# EAGLE design dedo_prog (EAGLE 9.4.2)
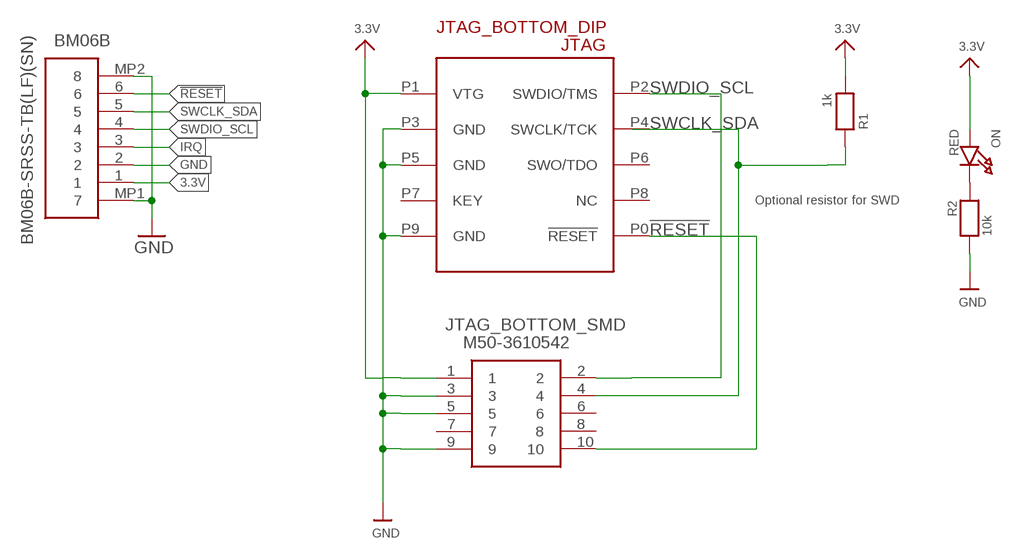
[diagram p0: schematic, sheet 1]

## Parts
BM06B  BM06B-SRSS-TB(LF)(SN)  [BM06BSRSSTBLFSN]
JTAG_BOTTOM_DIP  JTAGICE3-CONNECTOR50MIL-THT  [JTAGICE3-50MIL]
JTAG_BOTTOM_SMD  M50-3610542  [M503610542]
ON  RED  LED0603  [CHIPLED_0603]
R1  1k  RESISTOR_0402  [_0402@1]
R2  10k  RESISTOR_0402  [_0402@1]

## Nets
3.3V: BM06B.1 JTAG_BOTTOM_DIP.P1(VTG) JTAG_BOTTOM_SMD.1 ON.A R1.2
!RESET: BM06B.6 JTAG_BOTTOM_DIP.P0(!RESET) JTAG_BOTTOM_SMD.10
GND: BM06B.2 BM06B.MP1 BM06B.MP2 JTAG_BOTTOM_DIP.P3(GND) JTAG_BOTTOM_DIP.P5(GND) JTAG_BOTTOM_DIP.P9(GND) JTAG_BOTTOM_SMD.3 JTAG_BOTTOM_SMD.5 JTAG_BOTTOM_SMD.9 R2.1
IRQ: BM06B.3
N$2: ON.C R2.2
SWCLK_SDA: BM06B.5 JTAG_BOTTOM_DIP.P4(SWCLK/TCK) JTAG_BOTTOM_SMD.4 R1.1
SWDIO_SCL: BM06B.4 JTAG_BOTTOM_DIP.P2(SWDIO/TMS) JTAG_BOTTOM_SMD.2
Unconnected: JTAG_BOTTOM_DIP.P6(SWO/TDO) JTAG_BOTTOM_DIP.P7(KEY) JTAG_BOTTOM_DIP.P8(NC) JTAG_BOTTOM_SMD.6 JTAG_BOTTOM_SMD.7 JTAG_BOTTOM_SMD.8

## Notes on the sheet
- Optional resistor for SWD

## Library data of the parts
BM06B = 0SoK:BM06B-SRSS-TB(LF)(SN): connector,multipole PCB use,BM06B-SRSS-T JST SH Series, 1mm Pitch 6 Way 1 Row Straight PCB Header, Solder Termination, 1A Source: Datasheet <http://docs-emea.rs-online.com/webdocs/13ce/0900766b813ce45e.pdf>; DESCRIPTION: connector,multipole PCB use,BM06B-SRSS-T JST SH Series, 1mm Pitch 6 Way 1 Row Straight PCB Header, Solder Termination, 1A; HEIGHT: 4.25mm; MANUFACTURER_NAME: JST (JAPAN SOLDERLESS TERMINALS); MANUFACTURER_PART_NUMBER: BM06B-SRSS-TB(LF)(SN); RS_PART_NUMBER: 5468782; RS_PRICE-STOCK: https://uk.rs-online.com/web/p/products/5468782
JTAG_BOTTOM_DIP = 0SoK:JTAGICE3-CONNECTOR: JTAG Connector for JTAGICE3 Designed originally by Michael Hohl <https://www.michaelhohl.net/> in May 2013. Edit in July 2019 by NekuNeko <https://github.com/nekuneko//>. You are free to use, edit and distribute this library.
JTAG_BOTTOM_SMD = SamacSys_Parts:M50-3610542: HARWIN - M50-3610542 - CONNECTOR, HEADER, 10POS, 2ROW, 1.27MM Source: Datasheet <https://cdn.harwin.com/pdfs/M50-361.pdf>; DESCRIPTION: HARWIN - M50-3610542 - CONNECTOR, HEADER, 10POS, 2ROW, 1.27MM; HEIGHT: 5.03mm; MANUFACTURER_NAME: HARWIN; MANUFACTURER_PART_NUMBER: M50-3610542; MOUSER_PART_NUMBER: 855-M50-3610542; MOUSER_PRICE-STOCK: https://www.mouser.com/Search/Refine.aspx?Keyword=855-M50-3610542
ON = microbuilder:LED: LED 0603 - 0603 Surface Mount Package 2mA: Green LED - Low Power (3.9mcd, 2ma, 1.7Vf) - Digikey: 475-2709-2-ND Orange LED - Low Power (9.8mcd, 2ma, 1.8Vf) - Digikey: 475-1194-2-ND Red LED - Low Power (5mcd, 2ma, 1.8Vf) - Digikey: 475-1195-2-ND Yellow LED - Low Power (7mcd, 2ma, 1.8Vf) - Digikey: 475-1196-2-ND 5mA: Blue LED - Low Power (17mcd, 5ma, 2.9Vf) - Digikey: LNJ937W8CRACT-ND 0805 - 0805 Surface Mount Package 2mA: Red LED (8.8mcd, 2mA, 1.8Vf, Clear) - Low Power [Digikey: 475-2510-1-ND] Green LED (5mcd, 2mA, 1.8Vf, Clear) - Low Power [Digikey: 475-2730-1-ND] Yellow LED (11.3mcd, 2mA, 1.8Vf, Clear) - Low Power [Digikey: 475-2555-1-ND] 20mA: Red LED (104mcd, 20mA, Diffused) - LS R976 [Digikey: 475-1278-6-ND] Red LED (12mcd, 20mA, 2.0Vf, Clear) - APT2012EC [Digikey: 754-1128-1-ND] Green LED (15mcd, 20mA, 2.2Vf, Clear) - APT2012GC [Digikey: 754-1131-1-ND] Orange LED (160mcd, 20mA, 2.1Vf, Clear) - APT2012SECK [Digikey: 754-1130-1-ND] 1206 - 1206 Surface Mount Package Green LED (26mcd, 20mA, Diffused) - LG N971 [Digikey: 475-1407-6-ND] Red LED (15mcd, 20mA, Diffused) - LH N974 [Digikey: 475-1416-6-ND]
R1 R2 = microbuilder:RESISTOR: Resistors 0402 - 0402 Surface Mount Package 22 Ohm 1% 1/16W [Digikey: 311-22.0LRTR-ND] 33 Ohm 5% 1/16W 1.0K 5% 1/16W 1.5K 5% 1/16W 2.0K 1% 1/16W 10.0K 1% 1/16W [Digikey: 311-10.0KLRTR-ND] 10.0K 5% 1/16W [Digikey: RMCF0402JT10K0TR-ND] 12.1K 1% 1/16W [Digikey: 311-22.0LRTR-ND] 100.0K 5% 1/16W 0603 - 0603 Surface Mount Package 0 Ohm 1/10 Watt 1% Resistor 15 Ohm 1/10 Watt 1% Resistor 33 Ohm 1/10 Watt 1% Resistor 49.9 Ohm 1/10 Watt 1% Resistor 100 Ohm 1/10 Watt 1% Resistor 150 Ohm 1/10 Watt 1% Resistor 240 Ohm 1/10 Watt 1% Resistor 390 Ohm 1/10 Watt 1% Resistor 560 Ohm 1/10 Watt 1% Resistor 680 Ohm 1/10 Watt 1% Resistor 750 Ohm 1/10 Watt 1% Resistor 1.0K Ohm 1/10 Watt 1% Resistor 1.5K Ohm 1/10 Watt 1% Resistor 2.0K Ohm 1/10 Watt 1% Resistor 2.2K Ohm 1/10 Watt 1% Resistor 3.3K Ohm 1/10 Watt 1% Resistor 4.7K Ohm 1/10 Watt 1% Resistor 10.0K Ohm 1/10 Watt 1% Resistor 12.0K Ohm 1/10 Watt 1% Resistor 12.1K Ohm 1/10 Watt 1% Resistor 20.0K Ohm 1/10 Watt 1% Resistor 33.0K Ohm 1/10 Watt 1% Resistor 100.0K Ohm 1/10 Watt 1% Resistor 0805 - 0805 Surface Mount Package 0 Ohm 1/8 Watt 1% Resistor 33 Ohm 1/8 Watt 1% Resistor 100 Ohm 1/8 Watt 1% Resistor 150 Ohm 1/8 Watt 1% Resistor 200 Ohm 1/8 Watt 1% Resistor 240 Ohm 1/8 Watt 1% Resistor 330 Ohm 1/8 Watt 1% Resistor 390 Ohm 1/8 Watt 1% Resistor 470 Ohm 1/8 Watt 1% Resistor 1.0K Ohm 1/8 Watt 1% Resistor 1.5K Ohm 1/8 Watt 1% Resistor 2.0K Ohm 1/8 Watt 1% Resistor 4.7K Ohm 1/8 Watt 1% Resistor 5.1K Ohm 1/8 Watt 1% Resistor 5.6K Ohm 1/8 Watt 1% Resistor 10.0K Ohm 1/8 Watt 1% Resistor 22.0K Ohm 1/8 Watt 1% Resistor 33.0K Ohm 1/8 Watt 1% Resistor 100K Ohm 1/8 Watt 1% Resistor 1206 - 1206 Surface Mount Package 2012 - 2010 Surface Mount Package 0.11 Ohm 1/2 Watt 1% Resistor - Digikey: RHM.11UCT-ND

## Board
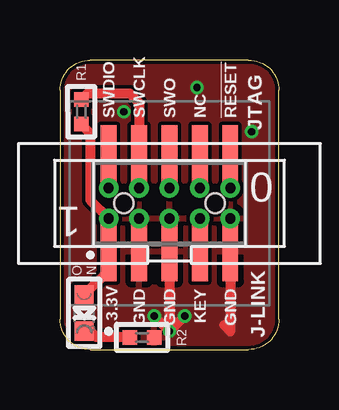
[diagram p1: board, top side]
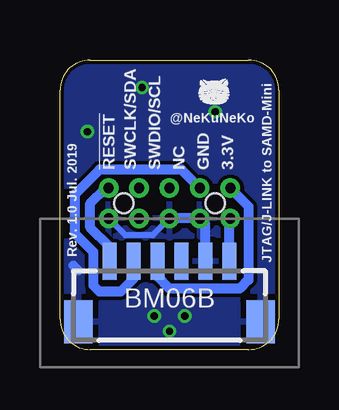
[diagram p2: board, bottom side, seen from below]

Size 9.14 x 12.06 mm. Coordinates in mm from the lower left corner, seen from the top.
Outline: 7.87,12.06 1.27,12.06 arc90 0,10.79 0,1.27 arc90 1.27,0 7.87,0 arc90 9.14,1.27 9.14,10.79 arc90 7.87,12.06
Copper layers (1*16): Top 0.035559375mm / dielectric 1.6mm / Bottom 0.035559375mm
Design rules "nekuneko": minimum track width 6mil, minimum drill 0.3mm, track to track 6mil, track to pad 6mil, pad to pad 6mil, via to via 6mil, smd to smd 6mil, copper to edge 6mil, drill to drill 6mil, minimum pad ring 5mil, minimum via ring 5mil, stop-mask expansion 2.5mil, vias tented up to drill 20mil, thermal gap 10mil

### Footprints (pad centres in the part's own frame; a part is rotated, then mirrored left to right if it is on the bottom)
BM06BSRSSTBLFSN = smd 0.6 x 1.55: 1 -2.5,-1.65; 2 -1.5,-1.65; 3 -0.5,-1.65; 4 0.5,-1.65; 5 1.5,-1.65; 6 2.5,-1.65 | smd 1.2 x 1.8: MP1 -3.8,0.875; MP2 3.8,0.875
JTAGICE3-50MIL = drill 0.432 pad 0.813: P0 -2.54,-0.635; P1 2.54,0.635; P2 2.54,-0.635; P3 1.27,0.635; P4 1.27,-0.635; P5 0,0.635; P6 0,-0.635; P7 -1.27,0.635; P8 -1.27,-0.635; P9 -2.54,0.635
M503610542 = smd 0.65 x 2.5: 1 -2.54,-2; 2 -2.54,2; 3 -1.27,-2; 4 -1.27,2; 5 0,-2; 6 0,2; 7 1.27,-2; 8 1.27,2; 9 2.54,-2; 10 2.54,2 | hole 0.8: -1.905,0; 1.905,0
CHIPLED_0603 = smd 0.8 x 0.8: A 0,-0.75; C 0,0.75
_0402@1 = smd 0.6 x 0.6: 1 -0.508,0; 2 0.508,0

### Placement (x,y rotation side)
BM06B  4.57,2.03 180 bottom
JTAG_BOTTOM_DIP  4.57,6.1 180 top
JTAG_BOTTOM_SMD  4.57,6.1 0 top
ON  1.02,1.52 180 top
R1  0.89,9.91 270 top
R2  3.43,0.51 180 top
U$1  [NEKO_2_1_TSTOP_TPLACE]  3.56,10.16 0 bottom

### Tracks (layer width: path | path; a pad name or v marks a point on that pad's centre or on a via)
3.3V
  Top 0.406: R1.2 1.27,9.02 1.27,6.22 JTAG_BOTTOM_DIP.P1 JTAG_BOTTOM_SMD.1 2.03,3.29 ON.A
  Bottom 0.406: BM06B.1 2.07,5.42 JTAG_BOTTOM_DIP.P1
!RESET
  Top 0.406: JTAG_BOTTOM_SMD.10 JTAG_BOTTOM_DIP.P0
  Bottom 0.406: JTAG_BOTTOM_DIP.P0 7.24,6.73 7.87,6.1 7.87,5.08 7.07,4.28 BM06B.6
GND  (via drill 0.3)
  Top 0.406: JTAG_BOTTOM_SMD.3 JTAG_BOTTOM_DIP.P3 | JTAG_BOTTOM_DIP.P5 JTAG_BOTTOM_SMD.5 v4.57,0.76 | JTAG_BOTTOM_DIP.P9 JTAG_BOTTOM_SMD.9 7.11,0.76 6.86,1.02 | v3.94,1.4 v4.57,0.76 | v5.21,1.4 v4.57,0.76
  Bottom 0.254: JTAG_BOTTOM_DIP.P5 5.27,4.76 6.41,4.76 JTAG_BOTTOM_DIP.P9
  Bottom 0.406: BM06B.2 3.07,5.23 JTAG_BOTTOM_DIP.P3 JTAG_BOTTOM_DIP.P5 | 8.37,3.29 8.57,3.49
  other vias: 2.67,9.91 5.71,10.92 8,9.08
  pour Top (isolate 0.012): 9.14,12.06 0,12.06 0,0 9.14,0
  pour Bottom (isolate 0.012): 9.14,12.06 0,12.06 0,0 9.14,0
N$2
  Top 0.406: R2.2 2.91,0.52 1.52,0.52 1.27,0.77 ON.C
SWCLK_SDA
  Top 0.406: R1.1 1.14,10.67 2.92,10.67 3.3,10.29 JTAG_BOTTOM_SMD.4 JTAG_BOTTOM_DIP.P4
  Bottom 0.406: JTAG_BOTTOM_DIP.P4 4.06,7.49 7.49,7.49 8.51,6.48 8.51,4.83 7.75,4.06 7.75,2.67 7.49,2.41 6.6,2.41 6.07,2.94 BM06B.5
SWDIO_SCL
  Top 0.406: JTAG_BOTTOM_SMD.2 JTAG_BOTTOM_DIP.P2
  Bottom 0.406: JTAG_BOTTOM_DIP.P2 1.27,5.97 1.27,4.45 1.27,2.91 1.64,2.54 4.57,2.54 5.08,3.05 BM06B.4

### Text on the board
tPlace: R1 | SWDIO | SWCLK | SWO | NC | !RESET | JTAG | O / N | 3.3V | GND | GND | KEY | GND | R2 | J-LINK
bPlace: @NeKuNeKo | JTAG/J-LINK to SAMD-Mini | 3.3V | GND | NC | SWDIO/SCL | SWCLK/SDA | !RESET | Rev. 1.0 Jul. 2019